# Altium schematic sheet ADS1298.SchDoc: ADS1298
size B; Organization: Myomo; Address1: 137 PORTLAND STREET, 4TH FLOOR; Address2: BOSTON, MA 02114; Address3: USA; SheetNumber: 4
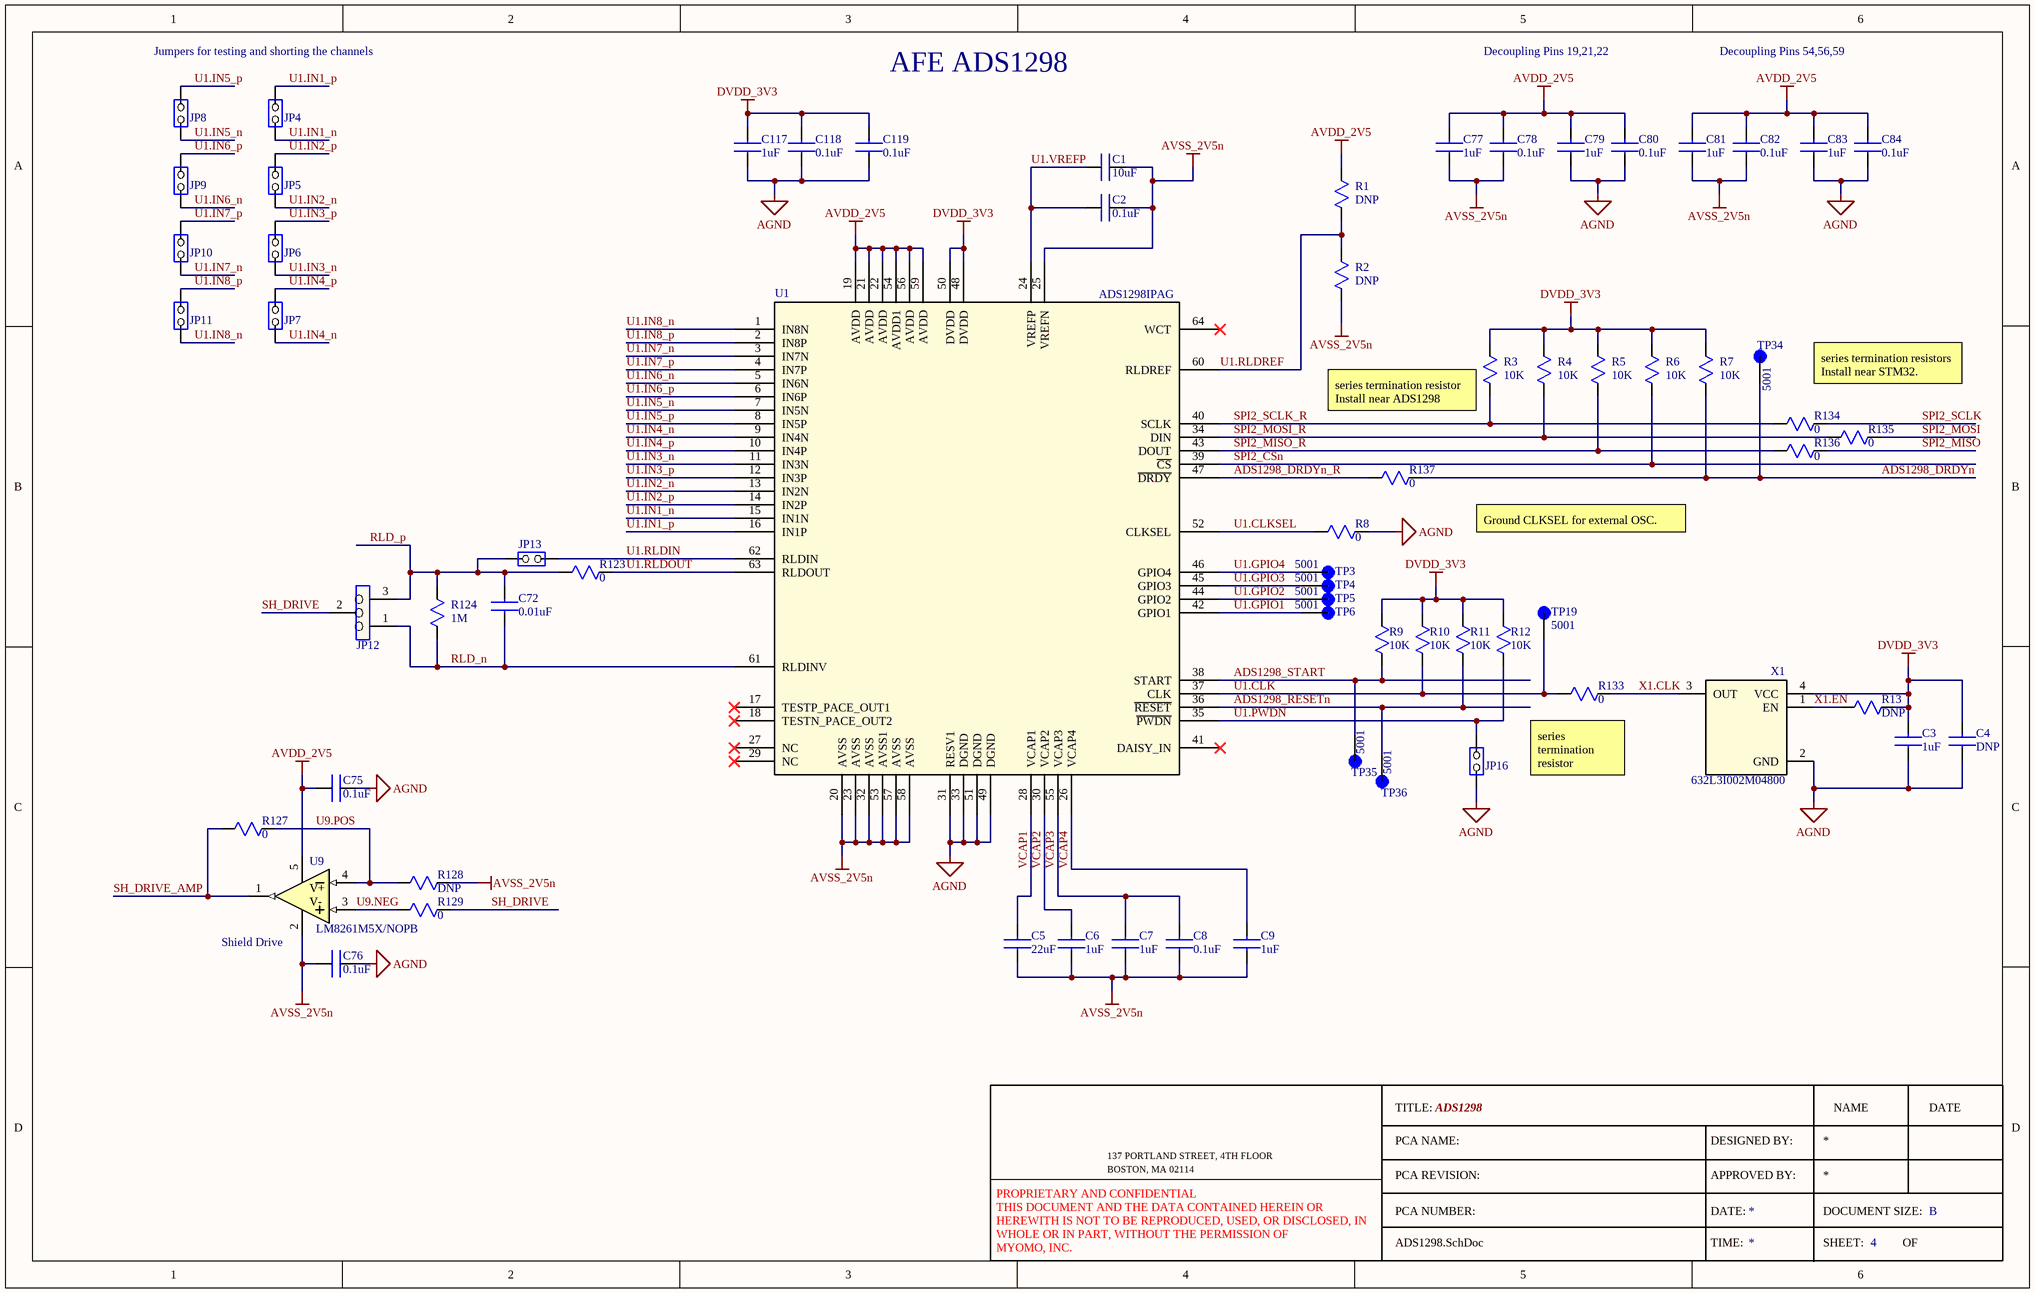
[diagram p0: ADS1298.SchDoc]

## Parts
C1  10uF  [1210]
C2  0.1uF  [0402]
C3  1uF  [0603]
C4  DNP  [0603]  (no BOM)
C5  22uF  [1210]
C6  1uF  [0603]
C7  1uF  [0603]
C8  0.1uF  [0402]
C9  1uF  [0603]
C72  0.01uF  [0603]
C75  0.1uF  [0402]
C76  0.1uF  [0402]
C77  1uF  [0603]
C78  0.1uF  [0402]
C79  1uF  [0603]
C80  0.1uF  [0402]
C81  1uF  [0603]
C82  0.1uF  [0402]
C83  1uF  [0603]
C84  0.1uF  [0402]
C117  1uF  [0603]
C118  0.1uF  [0402]
C119  0.1uF  [0402]
JP4  JP_1x2_TSW-102-07-F-S  [JP_1x2_TSW-102-07-F-S]  (value not drawn)
JP5  JP_1x2_TSW-102-07-F-S  [JP_1x2_TSW-102-07-F-S]  (value not drawn)
JP6  JP_1x2_TSW-102-07-F-S  [JP_1x2_TSW-102-07-F-S]  (value not drawn)
JP7  JP_1x2_TSW-102-07-F-S  [JP_1x2_TSW-102-07-F-S]  (value not drawn)
JP8  JP_1x2_TSW-102-07-F-S  [JP_1x2_TSW-102-07-F-S]  (value not drawn)
JP9  JP_1x2_TSW-102-07-F-S  [JP_1x2_TSW-102-07-F-S]  (value not drawn)
JP10  JP_1x2_TSW-102-07-F-S  [JP_1x2_TSW-102-07-F-S]  (value not drawn)
JP11  JP_1x2_TSW-102-07-F-S  [JP_1x2_TSW-102-07-F-S]  (value not drawn)
JP12  JP_1x3_TSW-103-07-F-S  [JP_1x3_TSW-103-07-F-S]  (value not drawn)
JP13  JP_1x2_TSW-102-07-F-S  [JP_1x2_TSW-102-07-F-S]  (value not drawn)
JP16  JP_1x2_TSW-102-07-F-S  [JP_1x2_TSW-102-07-F-S]  (value not drawn)
R1  DNP  [0402]  (no BOM)
R2  DNP  [0402]  (no BOM)
R3  10K  [0402]
R4  10K  [0402]
R5  10K  [0402]
R6  10K  [0402]
R7  10K  [0402]
R8  0  [0603]
R9  10K  [0402]
R10  10K  [0402]
R11  10K  [0402]
R12  10K  [0402]
R13  DNP  [0603]  (no BOM)
R123  0  [0603]
R124  1M  [0402]
R127  0  [0402]
R128  DNP  [0402]  (no BOM)
R129  0  [0402]
R133  0  [0603]
R134  0  [0402]
R135  0  [0402]
R136  0  [0402]
R137  0  [0603]
TP3  5001  [TP_CLIP_BLK_5001]
TP4  5001  [TP_CLIP_BLK_5001]
TP5  5001  [TP_CLIP_BLK_5001]
TP6  5001  [TP_CLIP_BLK_5001]
TP19  5001  [TP_CLIP_BLK_5001]
TP34  5001  [TP_CLIP_BLK_5001]
TP35  5001  [TP_CLIP_BLK_5001]
TP36  5001  [TP_CLIP_BLK_5001]
U1  ADS1298IPAG  [U_ADS1298IPAG]
U9  LM8261M5X/NOPB  [U_LM8261M5X/NOPB]
X1  632L3I002M04800  [XTAL_2.048MHZ_50PPM_3.3V]

## Nets
AGND: C3.2 C4.2 C75.2 C76.2 C79.2 C80.2 C83.2 C84.2 C117.2 C118.2 C119.2 JP16.1 R8.2 U1.31(RESV1) U1.33(DGND) U1.49(DGND) U1.51(DGND) X1.2(GND)
AVDD_2V5: C75.1 C77.1 C78.1 C79.1 C80.1 C81.1 C82.1 C83.1 C84.1 R1.1 U1.19(AVDD) U1.21(AVDD) U1.22(AVDD) U1.54(AVDD1) U1.56(AVDD) U1.59(AVDD) U9.5(V+)
AVSS_2V5n: C1.2 C2.2 C5.2 C6.2 C7.2 C8.2 C9.2 C76.1 C77.2 C78.2 C81.2 C82.2 R2.2 R128.2 U1.20(AVSS) U1.23(AVSS) U1.25(VREFN) U1.32(AVSS) U1.53(AVSS1) U1.57(AVSS) U1.58(AVSS) U9.2(V-)
DVDD_3V3: C3.1 C4.1 C117.1 C118.1 C119.1 R3.1 R4.1 R5.1 R6.1 R7.1 R9.1 R10.1 R11.1 R12.1 R13.2 U1.48(DVDD) U1.50(DVDD) X1.4(VCC)
ADS1298_DRDYn: R7.2 R137.2 TP34.TP
ADS1298_DRDYn_R: R137.1 U1.47(~{DRDY})
ADS1298_RESETn: R11.2 TP36.TP U1.36(~{RESET})
ADS1298_START: R9.2 TP35.TP U1.38(START)
RLD_n: C72.2 JP12.1 R124.2 U1.61(RLDINV)
RLD_p: C72.1 JP12.3 JP13.1 R123.1 R124.1
SH_DRIVE: JP12.2 R129.2
SH_DRIVE_AMP: R127.1 U9.1(OUT)
SPI2_CSn: R6.2 U1.39(~{CS})
SPI2_MISO: R136.2
SPI2_MISO_R: R5.2 R136.1 U1.43(DOUT)
SPI2_MOSI: R135.2
SPI2_MOSI_R: R4.2 R135.1 U1.34(DIN)
SPI2_SCLK: R134.2
SPI2_SCLK_R: R3.2 R134.1 U1.40(SCLK)
U1.CLK: R10.2 R133.1 TP19.TP U1.37(CLK)
U1.CLKSEL: R8.1 U1.52(CLKSEL)
U1.GPIO1: TP6.TP U1.42(GPIO1)
U1.GPIO2: TP5.TP U1.44(GPIO2)
U1.GPIO3: TP4.TP U1.45(GPIO3)
U1.GPIO4: TP3.TP U1.46(GPIO4)
U1.IN1_n: JP4.2 U1.15(IN1N)
U1.IN1_p: JP4.1 U1.16(IN1P)
U1.IN2_n: JP5.2 U1.13(IN2N)
U1.IN2_p: JP5.1 U1.14(IN2P)
U1.IN3_n: JP6.2 U1.11(IN3N)
U1.IN3_p: JP6.1 U1.12(IN3P)
U1.IN4_n: JP7.2 U1.9(IN4N)
U1.IN4_p: JP7.1 U1.10(IN4P)
U1.IN5_n: JP8.2 U1.7(IN5N)
U1.IN5_p: JP8.1 U1.8(IN5P)
U1.IN6_n: JP9.2 U1.5(IN6N)
U1.IN6_p: JP9.1 U1.6(IN6P)
U1.IN7_n: JP10.2 U1.3(IN7N)
U1.IN7_p: JP10.1 U1.4(IN7P)
U1.IN8_n: JP11.2 U1.1(IN8N)
U1.IN8_p: JP11.1 U1.2(IN8P)
U1.PWDN: JP16.2 R12.2 U1.35(~{PWDN})
U1.RLDIN: JP13.2 U1.62(RLDIN)
U1.RLDOUT: R123.2 U1.63(RLDOUT)
U1.RLDREF: R1.2 R2.1 U1.60(RLDREF)
U1.VREFP: C1.1 C2.1 U1.24(VREFP)
U9.NEG: R129.1 U9.3(IN+)
U9.POS: R127.2 R128.1 U9.4(IN-)
VCAP1: C5.1 U1.28(VCAP1)
VCAP2: C6.1 U1.30(VCAP2)
VCAP3: C7.1 C8.1 U1.55(VCAP3)
VCAP4: C9.1 U1.26(VCAP4)
X1.CLK: R133.2 X1.3(OUT)
X1.EN: R13.1 X1.1(EN)

Not connected (* = marked no-connect by the designer): U1 17(TESTP_PACE_OUT1)* 18(TESTN_PACE_OUT2)* 27(NC)* 29(NC)* 41(DAISY_IN)* 64(WCT)*

## Notes on the sheet
- Jumpers for testing and shorting the channels
- AFE ADS1298
- Decoupling Pins 19,21,22
- Decoupling Pins 54,56,59
- (near R3) series termination resistor
  Install near ADS1298
- series termination resistors
  Install near STM32.
- Ground CLKSEL for external OSC.
- (near R133) series termination resistor
- Shield Drive
- TITLE:
- NAME
- DATE
- PCA REVISION:
- PCA NAME:
- APPROVED BY:
- DESIGNED BY:
- PCA NUMBER:
- DATE:
- TIME:
- DOCUMENT SIZE:
- SHEET:
- OF
- B
- PROPRIETARY AND CONFIDENTIAL
  THIS DOCUMENT AND THE DATA CONTAINED HEREIN OR HEREWITH IS NOT TO BE REPRODUCED, USED, OR DISCLOSED, IN WHOLE OR IN PART, WITHOUT THE PERMISSION OF
  MYOMO, INC.

## Library data of the parts
C1 = C_1210_CER_10uF_25V_X7R: CAP CER 10UF 25V X7R 1210; MFG: SUMSUNG; MFGPN: CL32B106KAJNNNE; Myomo PN: 201-0004
C2 C8 C75 C76 C78 C80 C82 C84 C118 C119 = C_0402_CER_0.1uF_50V_X7R: CAP CER 0.1UF 50V X7R 0402; MFG: Samsung; MFGPN: CL05B104KB54PNC; Myomo PN: 201-0017
C3 C6 C7 C9 C77 C79 C81 C83 C117 = C_0603_CER_1uF_50V_X7R: CAP CER 1UF 50V X7R 0603; MFG: YAGEO; MFGPN: CC0603KRX7R9BB105; Myomo PN: 201-0006
C4 = C_0603_DNP: CAP CER 0603 DNP
C5 = C_1210_CER_22uF_25V_X7R: CAP CER 22UF 25V X7R 1210; MFG: SUMSUNG; MFGPN: CL32B226KAJNFNE; Myomo PN: 201-0007
C72 = C_0603_CER_0.01uF_100V_X7R: CAP CER 10000PF 100V X7R 0603; MFG: SAMSUNG; MFGPN: CL10B103KC8WPJL; Myomo PN: 201-0013
JP4-JP11 JP13 JP16 = JP_1x2_TSW-102-07-F-S: CONN HEADER VERT 2POS 2.54MM; MFG: SAMTEC; Myomo PN: 214-0001; MFGPN: TSW-102-07-F-S
JP12 = JP_1x3_TSW-103-07-F-S: CONN HEADER VERT 2POS 2.54MM; MFG: SAMTEC; Myomo PN: 214-0002; MFGPN: TSW-103-07-F-S
R1 R2 R128 = R_0402_DNP: RES 0402 DNP
R3-R7 R9-R12 = R_0402_10K_1%_1/10W: RES SMD 10K OHM 1% 1/10W 0402; MFG: Panasonic; MFGPN: ERJ-2RKF1002X; Myomo PN: 200-0021
R8 R123 R133 R137 = R_0603_0: RES 0 OHM JUMPER 1/10W 0603; MFG: YAGEO; MFGPN: RC0603FR-070RL; Myomo PN: 200-0007
R13 = R_0603_DNP: RES 0603 DNP
R124 = R_0402_1M_1%_1/10W: RES SMD 1M OHM 1% 1/10W 0402; MFG: Panasonic; MFGPN: ERJ-2RKF1004X; Myomo PN: 200-0028
R127 R129 R134-R136 = R_0402_0: RES 0 OHM JUMPER 1/10W 0402; MFG: YAGEO; MFGPN: RC0402FR-070RL; Myomo PN: 200-0018
TP3-TP6 TP19 TP34-TP36 = TP_CLIP_BLK_5001: PC TEST POINT MINIATURE BLACK; MFG: Keystone Electronics; Myomo PN: 213-0001; MFGPN: 5001
U1 = U_ADS1298IPAG: 8-Channel 24-bit ADC With Integrated ECG Front End; MFG: TI; Myomo PN: 204-0002; MFGPN: ADS1298IPAG; Supplier 1: Mouser; Supplier Part Number 1: 595-ADS1298IPAG
U9 = U_LM8261M5X/NOPB: IC OPAMP GP 1 CIRCUIT SOT23-5; MFG: Texas Instruments; Myomo PN: 204-0010; MFGPN: LM8261M5X/NOPB
X1 = XTAL_2.048MHZ_50PPM_3.3V: XTAL OSC XO 2.0480MHZ HCMOS SMD; MFG: CTS; Myomo PN: 205-0001; MFGPN: 632L3I002M04800; Supplier 1: Digikey; Supplier Part Number 1: CTX1438DKR-ND